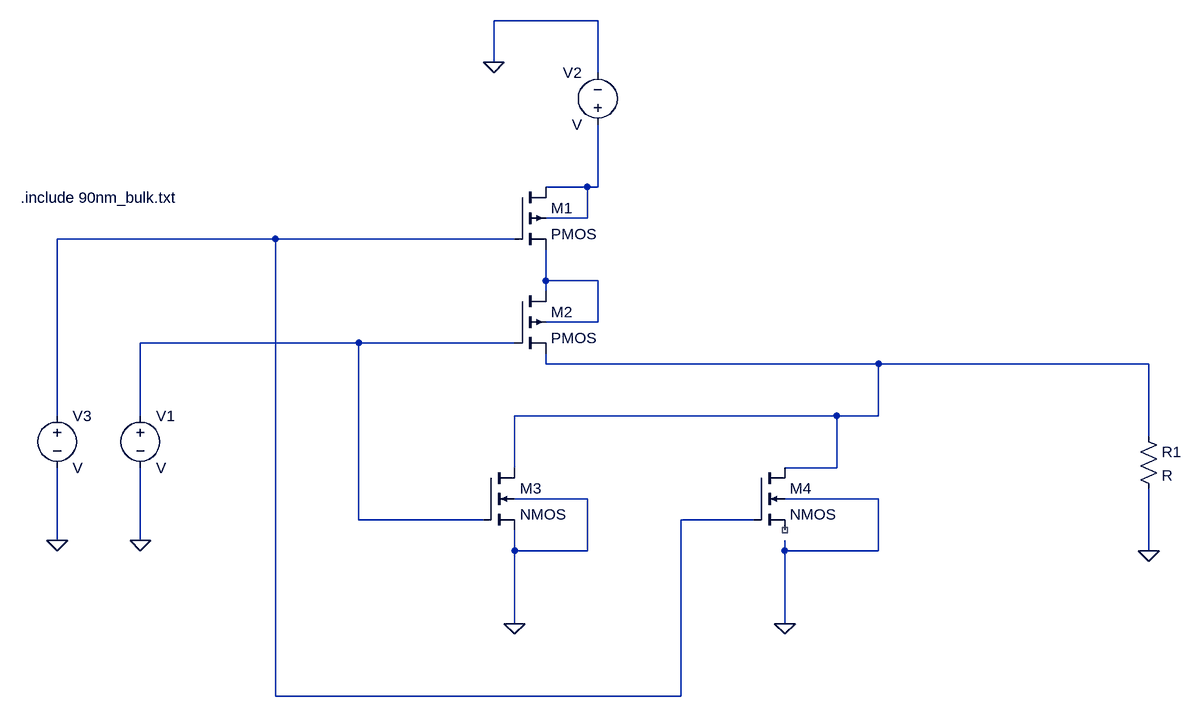
[diagram p0: schematic NOR_valve.asc]
NOR_valve.asc, the LTspice schematic file:
Version 4
SHEET 1 1656 708
WIRE 752 -336 592 -336
WIRE 592 -272 592 -336
WIRE 752 -256 752 -336
WIRE 736 -80 672 -80
WIRE 752 -80 752 -176
WIRE 752 -80 736 -80
WIRE 736 -32 736 -80
WIRE 736 -32 672 -32
WIRE 256 0 -80 0
WIRE 624 0 256 0
WIRE 672 64 672 16
WIRE 752 64 672 64
WIRE 672 80 672 64
WIRE 752 128 752 64
WIRE 752 128 672 128
WIRE 384 160 48 160
WIRE 624 160 384 160
WIRE 672 192 672 176
WIRE 1184 192 672 192
WIRE 1600 192 1184 192
WIRE -80 272 -80 0
WIRE 48 272 48 160
WIRE 1120 272 624 272
WIRE 1184 272 1184 192
WIRE 1184 272 1120 272
WIRE 1600 304 1600 192
WIRE 624 352 624 272
WIRE 1120 352 1120 272
WIRE 1120 352 1040 352
WIRE 736 400 624 400
WIRE 1184 400 1040 400
WIRE 384 432 384 160
WIRE 576 432 384 432
WIRE 992 432 880 432
WIRE -80 464 -80 352
WIRE 48 464 48 352
WIRE 624 480 624 448
WIRE 736 480 736 400
WIRE 736 480 624 480
WIRE 1040 480 1040 464
WIRE 1184 480 1184 400
WIRE 1184 480 1040 480
WIRE 1600 480 1600 384
WIRE 624 592 624 480
WIRE 1040 592 1040 480
WIRE 256 704 256 0
WIRE 880 704 880 432
WIRE 880 704 256 704
FLAG 48 464 0
FLAG 592 -272 0
FLAG 1600 480 0
FLAG -80 464 0
FLAG 624 592 0
FLAG 1040 592 0
SYMBOL voltage 48 256 R0
SYMATTR InstName V1
SYMBOL voltage 752 -160 R180
WINDOW 0 24 96 Left 2
WINDOW 3 24 16 Left 2
SYMATTR InstName V2
SYMBOL res 1584 288 R0
SYMATTR InstName R1
SYMBOL pmos4 624 -80 R0
SYMATTR InstName M1
SYMBOL pmos4 624 80 R0
SYMATTR InstName M2
SYMBOL voltage -80 256 R0
SYMATTR InstName V3
SYMBOL nmos4 576 352 R0
SYMATTR InstName M3
SYMBOL nmos4 992 352 R0
SYMATTR InstName M4
TEXT -136 -64 Left 2 !.include 90nm_bulk.txt

The netlist it stands for:
* NOR_valve.asc
V1 N004 0 V
V2 N001 0 V
R1 N005 0 R
M1 N001 N002 N003 N001 PMOS
M2 N003 N004 N005 N003 PMOS
V3 N002 0 V
M3 N005 N004 0 0 NMOS
M4 N005 N002 NC_01 0 NMOS
.model NMOS NMOS
.model PMOS PMOS
.lib standard.mos
.include 90nm_bulk.txt
.backanno
.end